# Altium schematic sheet WordClock_v20.SchDoc
size A3 portrait
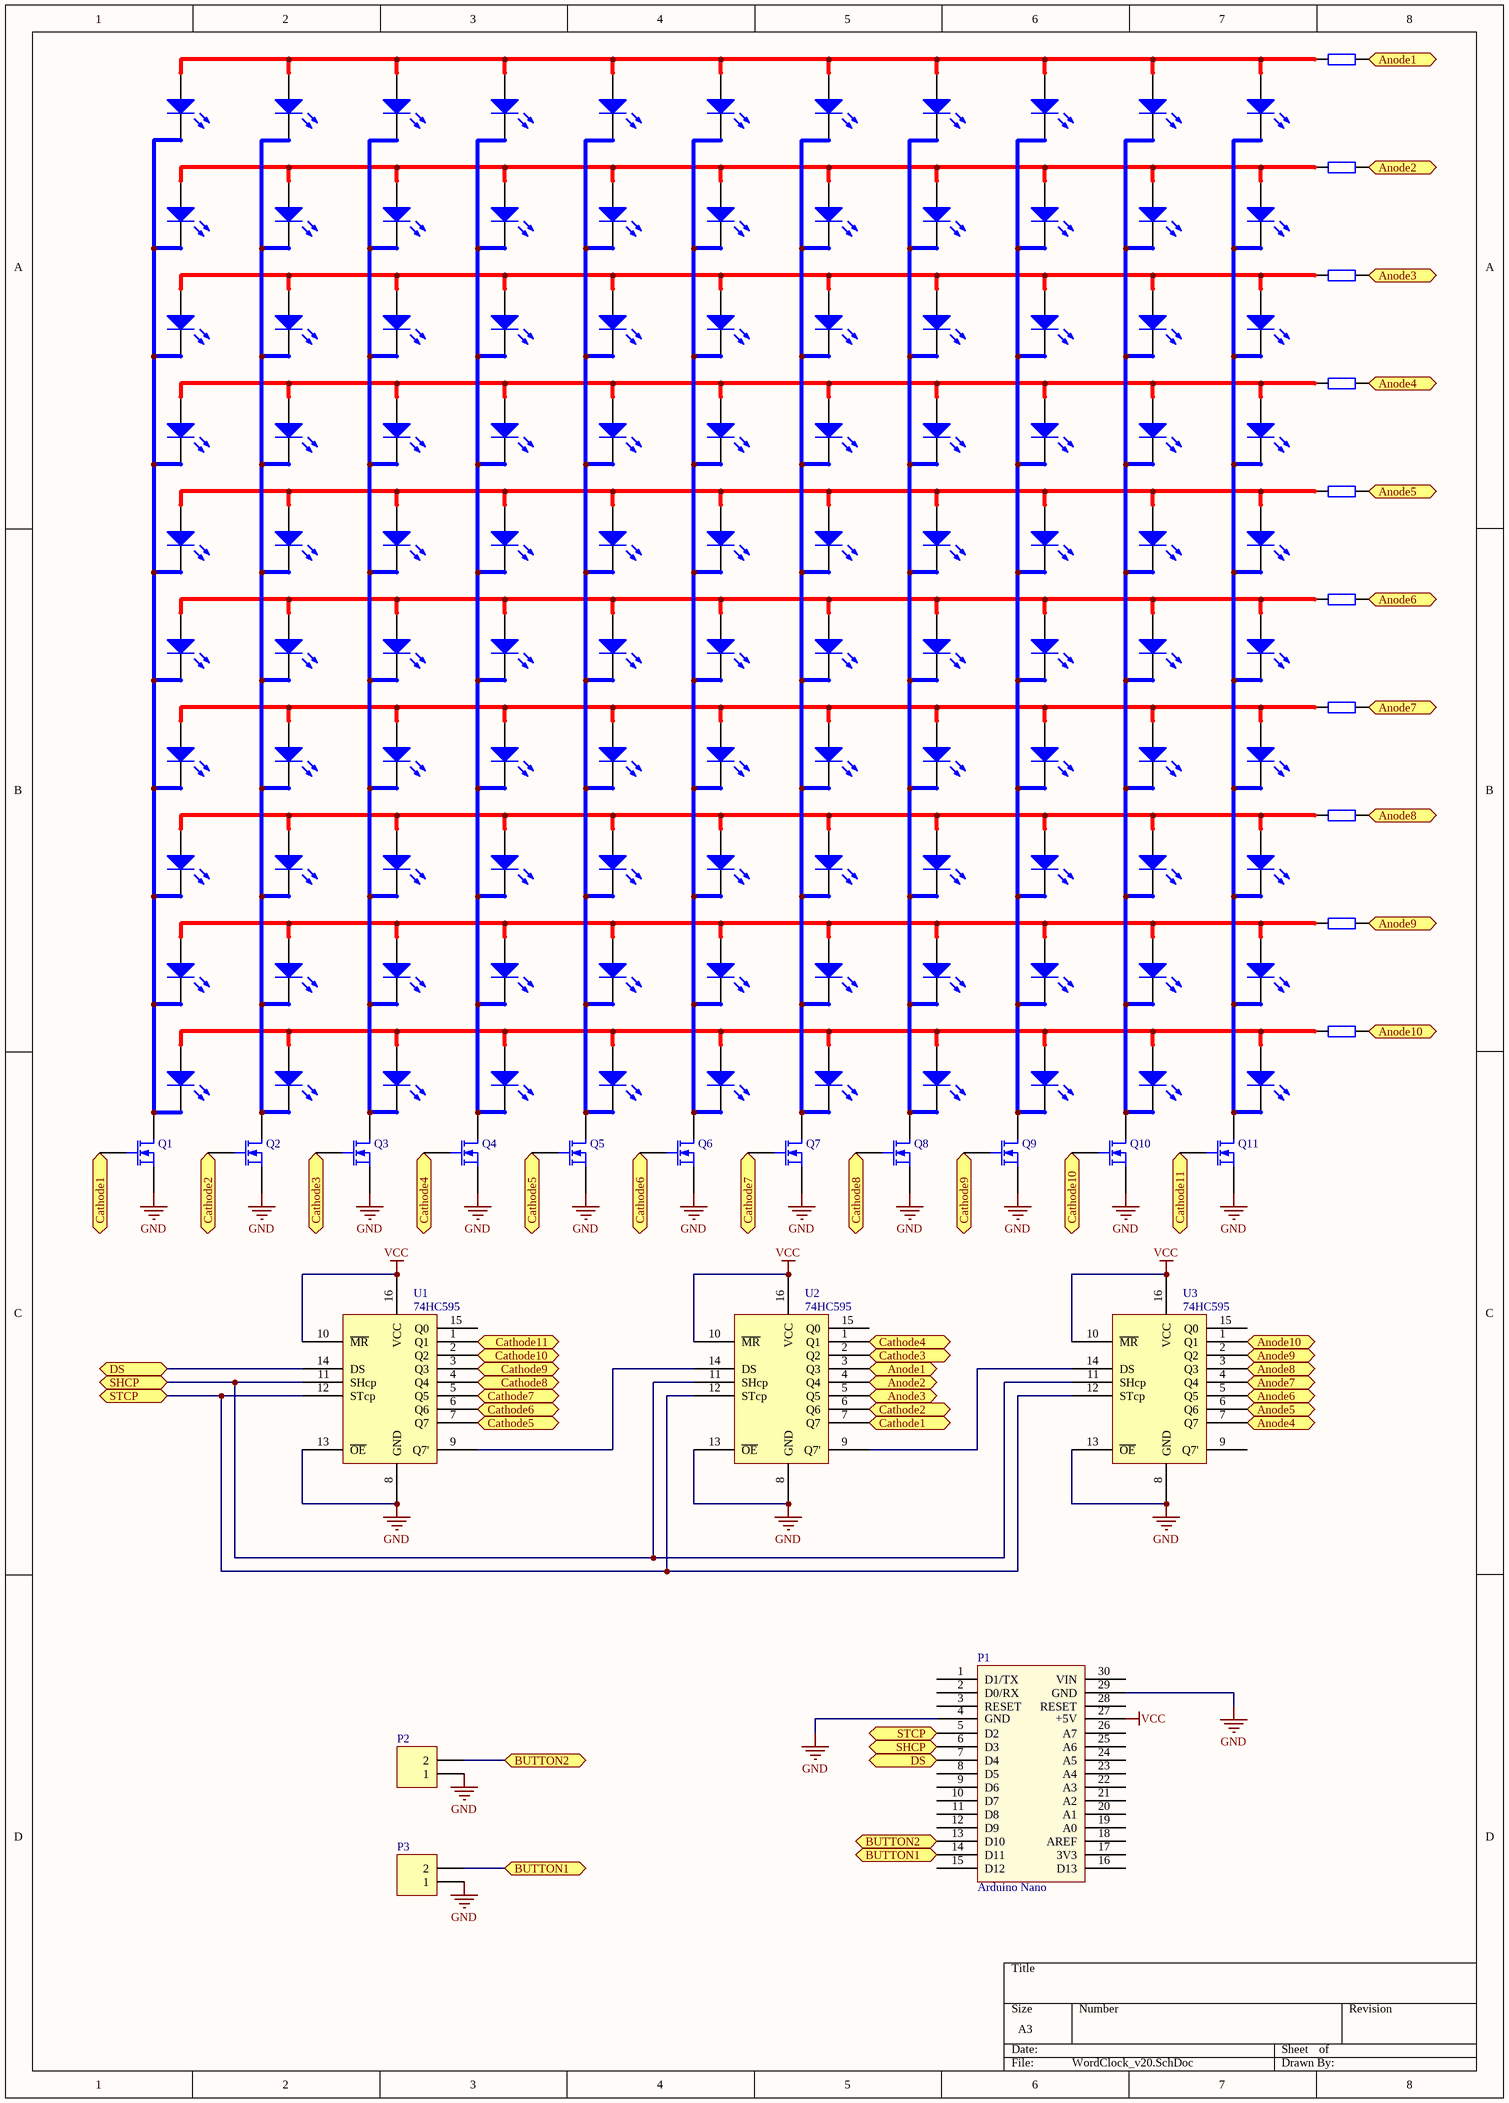
[diagram p0: WordClock_v20.SchDoc]

## Parts
D1  LED3  [LED5]  (value not drawn)
D2  LED3  [LED5]  (value not drawn)
D3  LED3  [LED5]  (value not drawn)
D4  LED3  [LED5]  (value not drawn)
D5  LED3  [LED5]  (value not drawn)
D6  LED3  [LED5]  (value not drawn)
D7  LED3  [LED5]  (value not drawn)
D8  LED3  [LED5]  (value not drawn)
D9  LED3  [LED5]  (value not drawn)
D10  LED3  [LED5]  (value not drawn)
D11  LED3  [LED5]  (value not drawn)
D12  LED3  [LED5]  (value not drawn)
D13  LED3  [LED5]  (value not drawn)
D14  LED3  [LED5]  (value not drawn)
D15  LED3  [LED5]  (value not drawn)
D16  LED3  [LED5]  (value not drawn)
D17  LED3  [LED5]  (value not drawn)
D18  LED3  [LED5]  (value not drawn)
D19  LED3  [LED5]  (value not drawn)
D20  LED3  [LED5]  (value not drawn)
D21  LED3  [LED5]  (value not drawn)
D22  LED3  [LED5]  (value not drawn)
D23  LED3  [LED5]  (value not drawn)
D24  LED3  [LED5]  (value not drawn)
D25  LED3  [LED5]  (value not drawn)
D26  LED3  [LED5]  (value not drawn)
D27  LED3  [LED5]  (value not drawn)
D28  LED3  [LED5]  (value not drawn)
D29  LED3  [LED5]  (value not drawn)
D30  LED3  [LED5]  (value not drawn)
D31  LED3  [LED5]  (value not drawn)
D32  LED3  [LED5]  (value not drawn)
D33  LED3  [LED5]  (value not drawn)
D34  LED3  [LED5]  (value not drawn)
D35  LED3  [LED5]  (value not drawn)
D36  LED3  [LED5]  (value not drawn)
D37  LED3  [LED5]  (value not drawn)
D38  LED3  [LED5]  (value not drawn)
D39  LED3  [LED5]  (value not drawn)
D40  LED3  [LED5]  (value not drawn)
D41  LED3  [LED5]  (value not drawn)
D42  LED3  [LED5]  (value not drawn)
D43  LED3  [LED5]  (value not drawn)
D44  LED3  [LED5]  (value not drawn)
D45  LED3  [LED5]  (value not drawn)
D46  LED3  [LED5]  (value not drawn)
D47  LED3  [LED5]  (value not drawn)
D48  LED3  [LED5]  (value not drawn)
D49  LED3  [LED5]  (value not drawn)
D50  LED3  [LED5]  (value not drawn)
D51  LED3  [LED5]  (value not drawn)
D52  LED3  [LED5]  (value not drawn)
D53  LED3  [LED5]  (value not drawn)
D54  LED3  [LED5]  (value not drawn)
D55  LED3  [LED5]  (value not drawn)
D56  LED3  [LED5]  (value not drawn)
D57  LED3  [LED5]  (value not drawn)
D58  LED3  [LED5]  (value not drawn)
D59  LED3  [LED5]  (value not drawn)
D60  LED3  [LED5]  (value not drawn)
D61  LED3  [LED5]  (value not drawn)
D62  LED3  [LED5]  (value not drawn)
D63  LED3  [LED5]  (value not drawn)
D64  LED3  [LED5]  (value not drawn)
D65  LED3  [LED5]  (value not drawn)
D66  LED3  [LED5]  (value not drawn)
D67  LED3  [LED5]  (value not drawn)
D68  LED3  [LED5]  (value not drawn)
D69  LED3  [LED5]  (value not drawn)
D70  LED3  [LED5]  (value not drawn)
D71  LED3  [LED5]  (value not drawn)
D72  LED3  [LED5]  (value not drawn)
D73  LED3  [LED5]  (value not drawn)
D74  LED3  [LED5]  (value not drawn)
D75  LED3  [LED5]  (value not drawn)
D76  LED3  [LED5]  (value not drawn)
D77  LED3  [LED5]  (value not drawn)
D78  LED3  [LED5]  (value not drawn)
D79  LED3  [LED5]  (value not drawn)
D80  LED3  [LED5]  (value not drawn)
D81  LED3  [LED5]  (value not drawn)
D82  LED3  [LED5]  (value not drawn)
D83  LED3  [LED5]  (value not drawn)
D84  LED3  [LED5]  (value not drawn)
D85  LED3  [LED5]  (value not drawn)
D86  LED3  [LED5]  (value not drawn)
D87  LED3  [LED5]  (value not drawn)
D88  LED3  [LED5]  (value not drawn)
D89  LED3  [LED5]  (value not drawn)
D90  LED3  [LED5]  (value not drawn)
D91  LED3  [LED5]  (value not drawn)
D92  LED3  [LED5]  (value not drawn)
D93  LED3  [LED5]  (value not drawn)
D94  LED3  [LED5]  (value not drawn)
D95  LED3  [LED5]  (value not drawn)
D96  LED3  [LED5]  (value not drawn)
D97  LED3  [LED5]  (value not drawn)
D98  LED3  [LED5]  (value not drawn)
D99  LED3  [LED5]  (value not drawn)
D100  LED3  [LED5]  (value not drawn)
D101  LED3  [LED5]  (value not drawn)
D102  LED3  [LED5]  (value not drawn)
D103  LED3  [LED5]  (value not drawn)
D104  LED3  [LED5]  (value not drawn)
D105  LED3  [LED5]  (value not drawn)
D106  LED3  [LED5]  (value not drawn)
D107  LED3  [LED5]  (value not drawn)
D108  LED3  [LED5]  (value not drawn)
D109  LED3  [LED5]  (value not drawn)
D110  LED3  [LED5]  (value not drawn)
P1  Arduino Nano  [Arduino Nano]
P2  Header 2  [DTS 65N]  (value not drawn)
P3  Header 2  [DTS 65N]  (value not drawn)
Q1  (no value)  [SOT23_L]
Q2  (no value)  [SOT23_L]
Q3  (no value)  [SOT23_L]
Q4  (no value)  [SOT23_L]
Q5  (no value)  [SOT23_L]
Q6  (no value)  [SOT23_L]
Q7  (no value)  [SOT23_L]
Q8  (no value)  [SOT23_L]
Q9  (no value)  [SOT23_L]
Q10  (no value)  [SOT23_L]
Q11  (no value)  [SOT23_L]
R1  Res2  [SMD-1206]  (value not drawn)
R2  Res2  [SMD-1206]  (value not drawn)
R3  Res2  [SMD-1206]  (value not drawn)
R4  Res2  [SMD-1206]  (value not drawn)
R5  Res2  [SMD-1206]  (value not drawn)
R6  Res2  [SMD-1206]  (value not drawn)
R7  Res2  [SMD-1206]  (value not drawn)
R8  Res2  [SMD-1206]  (value not drawn)
R9  Res2  [SMD-1206]  (value not drawn)
R10  Res2  [SMD-1206]  (value not drawn)
U1  74HC595  [SOIC16_M]
U2  74HC595  [SOIC16_M]
U3  74HC595  [SOIC16_M]

## Ports
Anode1, Anode2, Anode3, Anode4, Anode5, Anode6, Anode7, Anode8, Anode9, Anode10, BUTTON1, BUTTON2, Cathode1, Cathode2, Cathode3, Cathode4, Cathode5, Cathode6, Cathode7, Cathode8, Cathode9, Cathode10, Cathode11, DS, SHCP, STCP

## Nets
GND: P1.4(GND) P1.29(GND) P2.1 P3.1 Q1.3(S) Q2.3(S) Q3.3(S) Q4.3(S) Q5.3(S) Q6.3(S) Q7.3(S) Q8.3(S) Q9.3(S) Q10.3(S) Q11.3(S) U1.8(GND) U1.13(~{OE}) U2.8(GND) U2.13(~{OE}) U3.8(GND) U3.13(~{OE})
VCC: P1.27(+5V) U1.10(~{MR}) U1.16(VCC) U2.10(~{MR}) U2.16(VCC) U3.10(~{MR}) U3.16(VCC)
Anode1: R1.2 U2.3(Q3) ; port Anode1
Anode2: R2.2 U2.4(Q4) ; port Anode2
Anode3: R3.2 U2.5(Q5) ; port Anode3
Anode4: R4.2 U3.7(Q7) ; port Anode4
Anode5: R5.2 U3.6(Q6) ; port Anode5
Anode6: R6.2 U3.5(Q5) ; port Anode6
Anode7: R7.2 U3.4(Q4) ; port Anode7
Anode8: R8.2 U3.3(Q3) ; port Anode8
Anode9: R9.2 U3.2(Q2) ; port Anode9
Anode10: R10.2 U3.1(Q1) ; port Anode10
BUTTON1: P1.14(D11) P3.2 ; port BUTTON1
BUTTON2: P1.13(D10) P2.2 ; port BUTTON2
Cathode1: Q1.2(G) U2.7(Q7) ; port Cathode1
Cathode2: Q2.2(G) U2.6(Q6) ; port Cathode2
Cathode3: Q3.2(G) U2.2(Q2) ; port Cathode3
Cathode4: Q4.2(G) U2.1(Q1) ; port Cathode4
Cathode5: Q5.2(G) U1.7(Q7) ; port Cathode5
Cathode6: Q6.2(G) U1.6(Q6) ; port Cathode6
Cathode7: Q7.2(G) U1.5(Q5) ; port Cathode7
Cathode8: Q8.2(G) U1.4(Q4) ; port Cathode8
Cathode9: Q9.2(G) U1.3(Q3) ; port Cathode9
Cathode10: Q10.2(G) U1.2(Q2) ; port Cathode10
Cathode11: Q11.2(G) U1.1(Q1) ; port Cathode11
DS: P1.7(D4) U1.14(DS) ; port DS
SHCP: P1.6(D3) U1.11(SHcp) U2.11(SHcp) U3.11(SHcp) ; port SHCP
STCP: P1.5(D2) U1.12(STcp) U2.12(STcp) U3.12(STcp) ; port STCP
NetD1_1: D1.1(A) D2.1(A) D3.1(A) D4.1(A) D5.1(A) D6.1(A) D7.1(A) D8.1(A) D9.1(A) D10.1(A) D11.1(A) R1.1
NetD1_2: D1.2(K) D12.2(K) D23.2(K) D34.2(K) D45.2(K) D56.2(K) D67.2(K) D78.2(K) D89.2(K) D100.2(K) Q1.1(D)
NetD2_2: D2.2(K) D13.2(K) D24.2(K) D35.2(K) D46.2(K) D57.2(K) D68.2(K) D79.2(K) D90.2(K) D101.2(K) Q2.1(D)
NetD3_2: D3.2(K) D14.2(K) D25.2(K) D36.2(K) D47.2(K) D58.2(K) D69.2(K) D80.2(K) D91.2(K) D102.2(K) Q3.1(D)
NetD4_2: D4.2(K) D15.2(K) D26.2(K) D37.2(K) D48.2(K) D59.2(K) D70.2(K) D81.2(K) D92.2(K) D103.2(K) Q4.1(D)
NetD5_2: D5.2(K) D16.2(K) D27.2(K) D38.2(K) D49.2(K) D60.2(K) D71.2(K) D82.2(K) D93.2(K) D104.2(K) Q5.1(D)
NetD6_2: D6.2(K) D17.2(K) D28.2(K) D39.2(K) D50.2(K) D61.2(K) D72.2(K) D83.2(K) D94.2(K) D105.2(K) Q6.1(D)
NetD7_2: D7.2(K) D18.2(K) D29.2(K) D40.2(K) D51.2(K) D62.2(K) D73.2(K) D84.2(K) D95.2(K) D106.2(K) Q7.1(D)
NetD8_2: D8.2(K) D19.2(K) D30.2(K) D41.2(K) D52.2(K) D63.2(K) D74.2(K) D85.2(K) D96.2(K) D107.2(K) Q8.1(D)
NetD9_2: D9.2(K) D20.2(K) D31.2(K) D42.2(K) D53.2(K) D64.2(K) D75.2(K) D86.2(K) D97.2(K) D108.2(K) Q9.1(D)
NetD10_2: D10.2(K) D21.2(K) D32.2(K) D43.2(K) D54.2(K) D65.2(K) D76.2(K) D87.2(K) D98.2(K) D109.2(K) Q10.1(D)
NetD11_2: D11.2(K) D22.2(K) D33.2(K) D44.2(K) D55.2(K) D66.2(K) D77.2(K) D88.2(K) D99.2(K) D110.2(K) Q11.1(D)
NetD12_1: D12.1(A) D13.1(A) D14.1(A) D15.1(A) D16.1(A) D17.1(A) D18.1(A) D19.1(A) D20.1(A) D21.1(A) D22.1(A) R2.1
NetD23_1: D23.1(A) D24.1(A) D25.1(A) D26.1(A) D27.1(A) D28.1(A) D29.1(A) D30.1(A) D31.1(A) D32.1(A) D33.1(A) R3.1
NetD34_1: D34.1(A) D35.1(A) D36.1(A) D37.1(A) D38.1(A) D39.1(A) D40.1(A) D41.1(A) D42.1(A) D43.1(A) D44.1(A) R4.1
NetD45_1: D45.1(A) D46.1(A) D47.1(A) D48.1(A) D49.1(A) D50.1(A) D51.1(A) D52.1(A) D53.1(A) D54.1(A) D55.1(A) R5.1
NetD56_1: D56.1(A) D57.1(A) D58.1(A) D59.1(A) D60.1(A) D61.1(A) D62.1(A) D63.1(A) D64.1(A) D65.1(A) D66.1(A) R6.1
NetD67_1: D67.1(A) D68.1(A) D69.1(A) D70.1(A) D71.1(A) D72.1(A) D73.1(A) D74.1(A) D75.1(A) D76.1(A) D77.1(A) R7.1
NetD78_1: D78.1(A) D79.1(A) D80.1(A) D81.1(A) D82.1(A) D83.1(A) D84.1(A) D85.1(A) D86.1(A) D87.1(A) D88.1(A) R8.1
NetD89_1: D89.1(A) D90.1(A) D91.1(A) D92.1(A) D93.1(A) D94.1(A) D95.1(A) D96.1(A) D97.1(A) D98.1(A) D99.1(A) R9.1
NetD100_1: D100.1(A) D101.1(A) D102.1(A) D103.1(A) D104.1(A) D105.1(A) D106.1(A) D107.1(A) D108.1(A) D109.1(A) D110.1(A) R10.1
NetU1_9: U1.9(Q7') U2.14(DS)
NetU2_9: U2.9(Q7') U3.14(DS)

Not connected (* = marked no-connect by the designer): P1 1(D1/TX) 2(D0/RX) 3(RESET) 8(D5) 9(D6) 10(D7) 11(D8) 12(D9) 15(D12) 16(D13) 17(3V3) 18(AREF) 19(A0) 20(A1) 21(A2) 22(A3) 23(A4) 24(A5) 25(A6) 26(A7) 28(RESET) 30(VIN); U1 15(Q0); U2 15(Q0); U3 9(Q7') 15(Q0)

## Library data of the parts
D1-D110 = LED3: Typical BLUE SiC LED; Published: 8-Jun-2000; LatestRevisionDate: 17-Dec-2003; LatestRevisionNote: PCB Footprint replaced.; DatasheetVersion: 16-Apr-2002; PackageVersion: 16-Apr-2002; PackageReference: 3.5X2.8X1.9; Publisher: Altium Limited; PackageDescription: SM LED; 2 C-Bend Leads; Body 3.5 x 2.8 x 1.9 mm, inc leads (LxWxH typ)
P2 P3 = Header 2: Header, 2-Pin; LatestRevisionDate: 17-Jul-2002; LatestRevisionNote: Re-released for DXP Platform.; Publisher: Altium Limited
Q1-Q11 = MOSFET-N: pin to pad: 2>3 3>2; Published: 8-Jun-2000; LatestRevisionDate: 17-Jul-2002; LatestRevisionNote: Re-released for DXP Platform.; PackageVersion: 1995/1996; PackageReference: E3; Publisher: Altium Limited; PackageDescription: TO, Flat Index; 3 In-Line, Axial Leads; Body Dia. 4.6mm; Lead Dia. 0.5 mm (max)
R1-R10 = Res2: Resistor; Value: 120R; Published: 8-Jun-2000; LatestRevisionDate: 17-Jul-2002; LatestRevisionNote: Re-released for DXP Platform.; PackageReference: AXIAL-0.4; Publisher: Altium Limited; PackageDescription: Axial Device, Thru-Hole; 2 Leads; 0.4 in Pin Spacing